# Altium schematic sheet 0_Overview.SchDoc
size A4; SheetNumber: 1; SheetTotal: 7
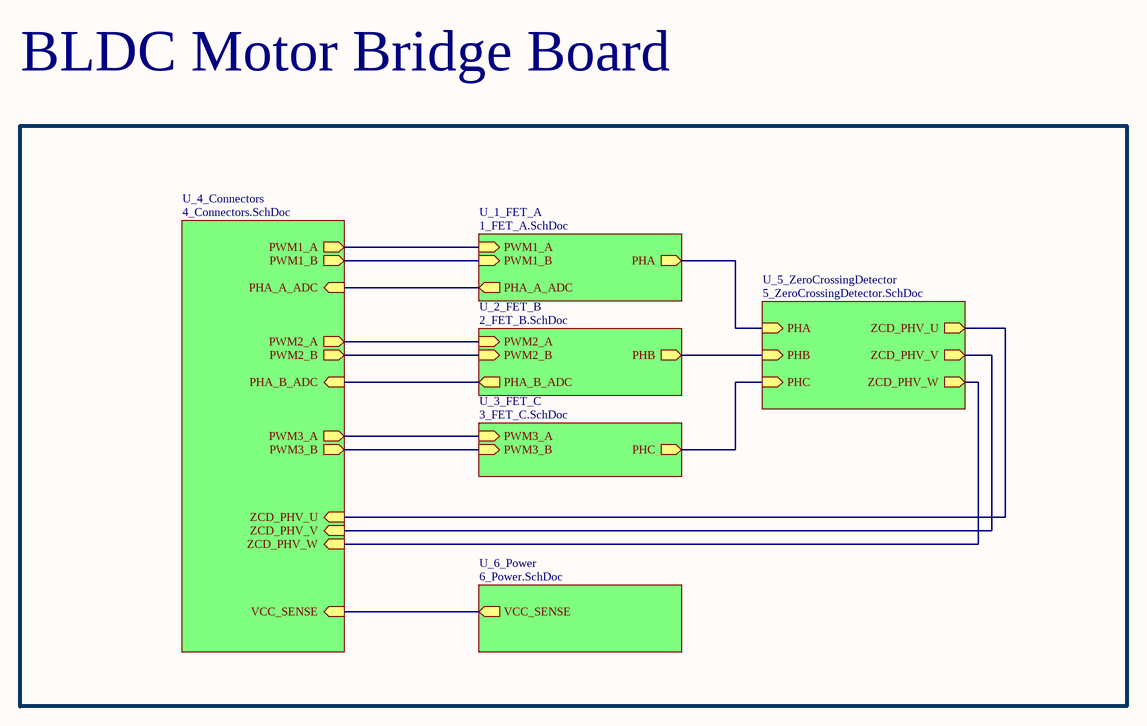
[diagram p0: 0_Overview.SchDoc]

## Sub-sheets
U_1_FET_A = 1_FET_A.SchDoc: PWM1_A (in), PWM1_B (in), PHA_A_ADC (out), PHA (out)
U_2_FET_B = 2_FET_B.SchDoc: PWM2_A (in), PWM2_B (in), PHA_B_ADC (out), PHB (out)
U_3_FET_C = 3_FET_C.SchDoc: PWM3_A (in), PWM3_B (in), PHC (out)
U_4_Connectors = 4_Connectors.SchDoc: PHA_B_ADC (in), PHA_A_ADC (in), PWM1_A (out), PWM1_B (out), PWM2_A (out), PWM2_B (out), PWM3_A (out), PWM3_B (out), ZCD_PHV_U (in), ZCD_PHV_V (in), ZCD_PHV_W (in), VCC_SENSE (in)
U_5_ZeroCrossingDetector = 5_ZeroCrossingDetector.SchDoc: PHA (in), PHB (in), PHC (in), ZCD_PHV_U (out), ZCD_PHV_V (out), ZCD_PHV_W (out)
U_6_Power = 6_Power.SchDoc: VCC_SENSE (out)

## Nets
(unnamed): sheet U_1_FET_A/PWM1_A, sheet U_4_Connectors/PWM1_A
(unnamed): sheet U_1_FET_A/PWM1_B, sheet U_4_Connectors/PWM1_B
(unnamed): sheet U_1_FET_A/PHA_A_ADC, sheet U_4_Connectors/PHA_A_ADC
(unnamed): sheet U_1_FET_A/PHA, sheet U_5_ZeroCrossingDetector/PHA
(unnamed): sheet U_2_FET_B/PWM2_A, sheet U_4_Connectors/PWM2_A
(unnamed): sheet U_2_FET_B/PWM2_B, sheet U_4_Connectors/PWM2_B
(unnamed): sheet U_2_FET_B/PHA_B_ADC, sheet U_4_Connectors/PHA_B_ADC
(unnamed): sheet U_2_FET_B/PHB, sheet U_5_ZeroCrossingDetector/PHB
(unnamed): sheet U_3_FET_C/PWM3_A, sheet U_4_Connectors/PWM3_A
(unnamed): sheet U_3_FET_C/PWM3_B, sheet U_4_Connectors/PWM3_B
(unnamed): sheet U_3_FET_C/PHC, sheet U_5_ZeroCrossingDetector/PHC
(unnamed): sheet U_4_Connectors/ZCD_PHV_U, sheet U_5_ZeroCrossingDetector/ZCD_PHV_U
(unnamed): sheet U_4_Connectors/ZCD_PHV_V, sheet U_5_ZeroCrossingDetector/ZCD_PHV_V
(unnamed): sheet U_4_Connectors/ZCD_PHV_W, sheet U_5_ZeroCrossingDetector/ZCD_PHV_W
(unnamed): sheet U_4_Connectors/VCC_SENSE, sheet U_6_Power/VCC_SENSE

## Notes on the sheet
- BLDC Motor Bridge Board